# EAGLE schematic timer555 (EAGLE 7.2.0)
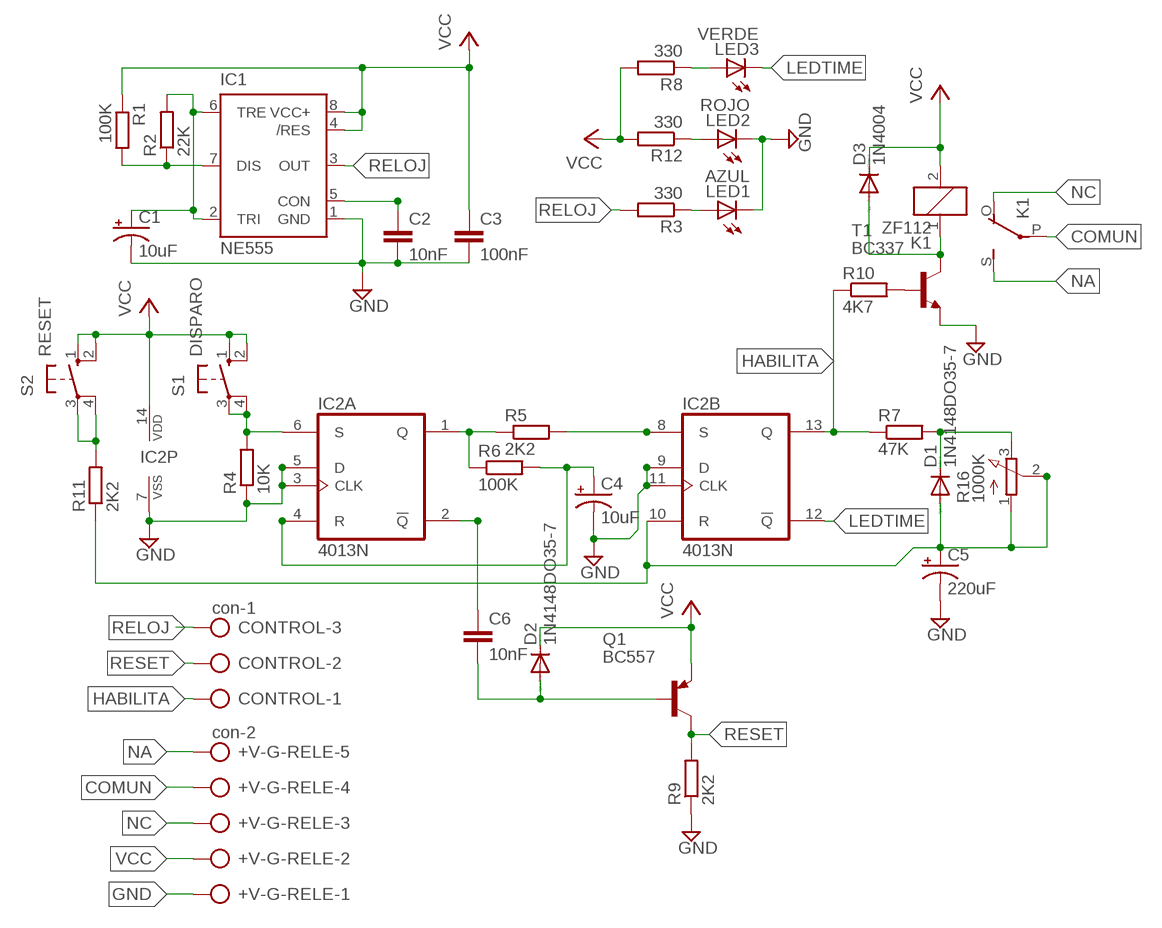
[diagram p0: schematic, sheet 1]

## Parts
+V-G-RELE  con-2  AK500/5  [AK500/5]
C1  10uF  CPOL-USE2.5-5  [E2,5-5]
C2  10nF  C-EU050-025X075  [C050-025X075]
C3  100nF  C-EU050-025X075  [C050-025X075]
C4  10uF  CPOL-USE2.5-5  [E2,5-5]
C5  220uF  CPOL-USE3.5-8  [E3,5-8]
C6  10nF  C-EU050-025X075  [C050-025X075]
CONTROL  con-1  AK500/3  [AK500/3]
D1  1N4148DO35-7  [DO35-7]
D2  1N4148DO35-7  [DO35-7]
D3  1N4004  [DO41-10]
IC1  NE555  [DIL-08]
IC2  4013N  [DIL14]
K1  ZF112  [ZF112]
LED1  AZUL  LED3MM  [LED3MM]
LED2  ROJO  LED3MM  [LED3MM]
LED3  VERDE  LED3MM  [LED3MM]
Q1  BC557  [TO92-EBC]
R1  100K  R-EU_0207/7  [0207/7]
R2  22K  R-EU_0207/7  [0207/7]
R3  330  R-EU_0207/7  [0207/7]
R4  10K  R-EU_0207/7  [0207/7]
R5  2K2  R-EU_0207/7  [0207/7]
R6  100K  R-EU_0207/7  [0207/7]
R7  47K  R-EU_0207/7  [0207/7]
R8  330  R-EU_0207/7  [0207/7]
R9  2K2  R-EU_0207/7  [0207/7]
R10  4K7  R-EU_0207/7  [0207/7]
R11  2K2  R-EU_0207/7  [0207/7]
R12  330  R-EU_0207/7  [0207/7]
R16  1000K  3RP/1610N  [3RP/1610N]
S1  DISPARO  10-XX  [B3F-10XX]
S2  RESET  10-XX  [B3F-10XX]
T1  BC337  [TO92]

## Nets
COMUN: +V-G-RELE.4 K1.P(2:P)
GND: +V-G-RELE.1 C1.- C2.2 C3.2 C4.- C5.- IC1.1(GND) IC2.3(A:CLK) IC2.5(A:D) IC2.7(P:VSS) IC2.9(B:D) IC2.11(B:CLK) LED1.K(C) LED2.K(C) R4.1 R9.1 T1.1(E)
HABILITA: CONTROL.1 IC2.13(B:Q) R7.1 R10.1
LEDTIME: IC2.12(B:!Q) LED3.K(C)
N$1: D3.A K1.1 T1.3(C)
N$6: IC2.1(A:Q) R5.1 R6.1
N$7: C1.+ IC1.2(TRI) IC1.6(TRE) R2.2
N$8: C4.+ IC2.4(A:R) R6.2
N$9: IC1.7(DIS) R1.2 R2.1
N$10: C2.1 IC1.5(CON)
N$11: D1.C R7.2 R16.3(E)
N$12: LED3.A R8.1
N$13: LED1.A R3.1
N$14: IC2.6(A:S) R4.2 S1.3(P) S1.4(P1)
N$15: C5.+ D1.A IC2.10(B:R) R11.1 R16.1(A) R16.2(S)
N$16: R11.2 S2.3(P) S2.4(P1)
N$17: LED2.A R12.1
N$18: R10.2 T1.2(B)
N$19: C6.1 IC2.2(A:!Q)
N$20: C6.2 D2.A Q1.B
NA: +V-G-RELE.5 K1.S(2:S)
NC: +V-G-RELE.3 K1.O(2:O)
RELOJ: CONTROL.3 IC1.3(OUT) R3.2
RESET: CONTROL.2 Q1.C R9.2
SET2: IC2.8(B:S) R5.2
VCC: +V-G-RELE.2 C3.1 D2.C D3.C IC1.4(/RES) IC1.8(VCC+) IC2.14(P:VDD) K1.2 Q1.E R1.1 R8.2 R12.2 S1.1(S) S1.2(S1) S2.1(S) S2.2(S1)

## Library data of the parts
+V-G-RELE = con-ptr500:AK500/5: CONNECTOR; OC_FARNELL: unknown; OC_NEWARK: unknown
C1 C4 C5 = rcl:CPOL-US: POLARIZED CAPACITOR, American symbol
C2 C3 C6 = rcl:C-EU: CAPACITOR, European symbol
CONTROL = con-ptr500:AK500/3: CONNECTOR; OC_FARNELL: unknown; OC_NEWARK: unknown
D1 D2 = diode:1N4148: DIODE high speed (Philips)
D3 = diode:1N4004: DIODE general purpose rectifier, 1 A
IC1 = st-microelectronics:NE555: General purpose bipolar Timer; MF: Arrow Electronics; MPN: NE555N; OC_FARNELL: 1467742; OC_NEWARK: 89K1486
IC2 = 40xx:4013: Dual D FLIP FLOP, set/reset
K1 = relay:ZF112: RELAY 1 x switch; OC_FARNELL: unknown; OC_NEWARK: unknown
LED1-LED3 = led:LED: LED OSRAM: - CHIPLED LG R971, LG N971, LY N971, LG Q971, LY Q971, LO R971, LY R971 LH N974, LH R974 LS Q976, LO Q976, LY Q976 LO Q996 - Hyper CHIPLED LW Q18S LB Q993, LB Q99A, LB R99A - SideLED LS A670, LO A670, LY A670, LG A670, LP A670 LB A673, LV A673, LT A673, LW A673 LH A674 LY A675 LS A676, LA A676, LO A676, LY A676, LW A676 LS A679, LY A679, LG A679 - Hyper Micro SIDELED® LS Y876, LA Y876, LO Y876, LY Y876 LT Y87S - SmartLED LW L88C, LW L88S LB L89C, LB L89S, LG L890 LS L89K, LO L89K, LY L89K LS L896, LA L896, LO L896, LY L896 - TOPLED LS T670, LO T670, LY T670, LG T670, LP T670 LSG T670, LSP T670, LSY T670, LOP T670, LYG T670 LG T671, LOG T671, LSG T671 LB T673, LV T673, LT T673, LW T673 LH T674 LS T676, LA T676, LO T676, LY T676, LB T676, LH T676, LSB T676, LW T676 LB T67C, LV T67C, LT T67C, LS T67K, LO T67K, LY T67K, LW E67C LS E67B, LA E67B, LO E67B, LY E67B, LB E67C, LV E67C, LT E67C LW T67C LS T679, LY T679, LG T679 LS T770, LO T770, LY T770, LG T770, LP T770 LB T773, LV T773, LT T773, LW T773 LH T774 LS E675, LA E675, LY E675, LS T675 LS T776, LA T776, LO T776, LY T776, LB T776 LHGB T686 LT T68C, LB T68C - Hyper Mini TOPLED® LB M676 - Mini TOPLED Santana® LG M470 LS M47K, LO M47K, LY M47K Source: http://www.osram.convergy.de LUXEON: - LUMILED® LXK2-PW12-R00, LXK2-PW12-S00, LXK2-PW14-U00, LXK2-PW14-V00 LXK2-PM12-R00, LXK2-PM12-S00, LXK2-PM14-U00 LXK2-PE12-Q00, LXK2-PE12-R00, LXK2-PE12-S00, LXK2-PE14-T00, LXK2-PE14-U00 LXK2-PB12-K00, LXK2-PB12-L00, LXK2-PB12-M00, LXK2-PB14-N00, LXK2-PB14-P00, LXK2-PB14-Q00 LXK2-PR12-L00, LXK2-PR12-M00, LXK2-PR14-Q00, LXK2-PR14-R00 LXK2-PD12-Q00, LXK2-PD12-R00, LXK2-PD12-S00 LXK2-PH12-R00, LXK2-PH12-S00 LXK2-PL12-P00, LXK2-PL12-Q00, LXK2-PL12-R00 Source: www.luxeon.com KINGBRIGHT: KA-3528ASYC Source: www.kingbright.com
Q1 = transistor-pnp:BC557*: PNP Transistror
R1-R12 = rcl:R-EU_: RESISTOR, European symbol
R16 = pot:3RP/1610N: 16mm Potentiometer one level Source: http://www.alphapotentiometers.net/html/16mm_pot_2.html
S1 S2 = switch-omron:10-XX: OMRON SWITCH; MPN: B3F-1000; OC_FARNELL: 176432; OC_NEWARK: 36M3542
T1 = transistor:BC337: NPN TRANSISTOR